# Altium schematic sheet ARM2toARM3Adapter.SchDoc: ARM2 to ARM3 Adapter
size A3; DocumentNumber: 1; SheetNumber: 1; SheetTotal: 1
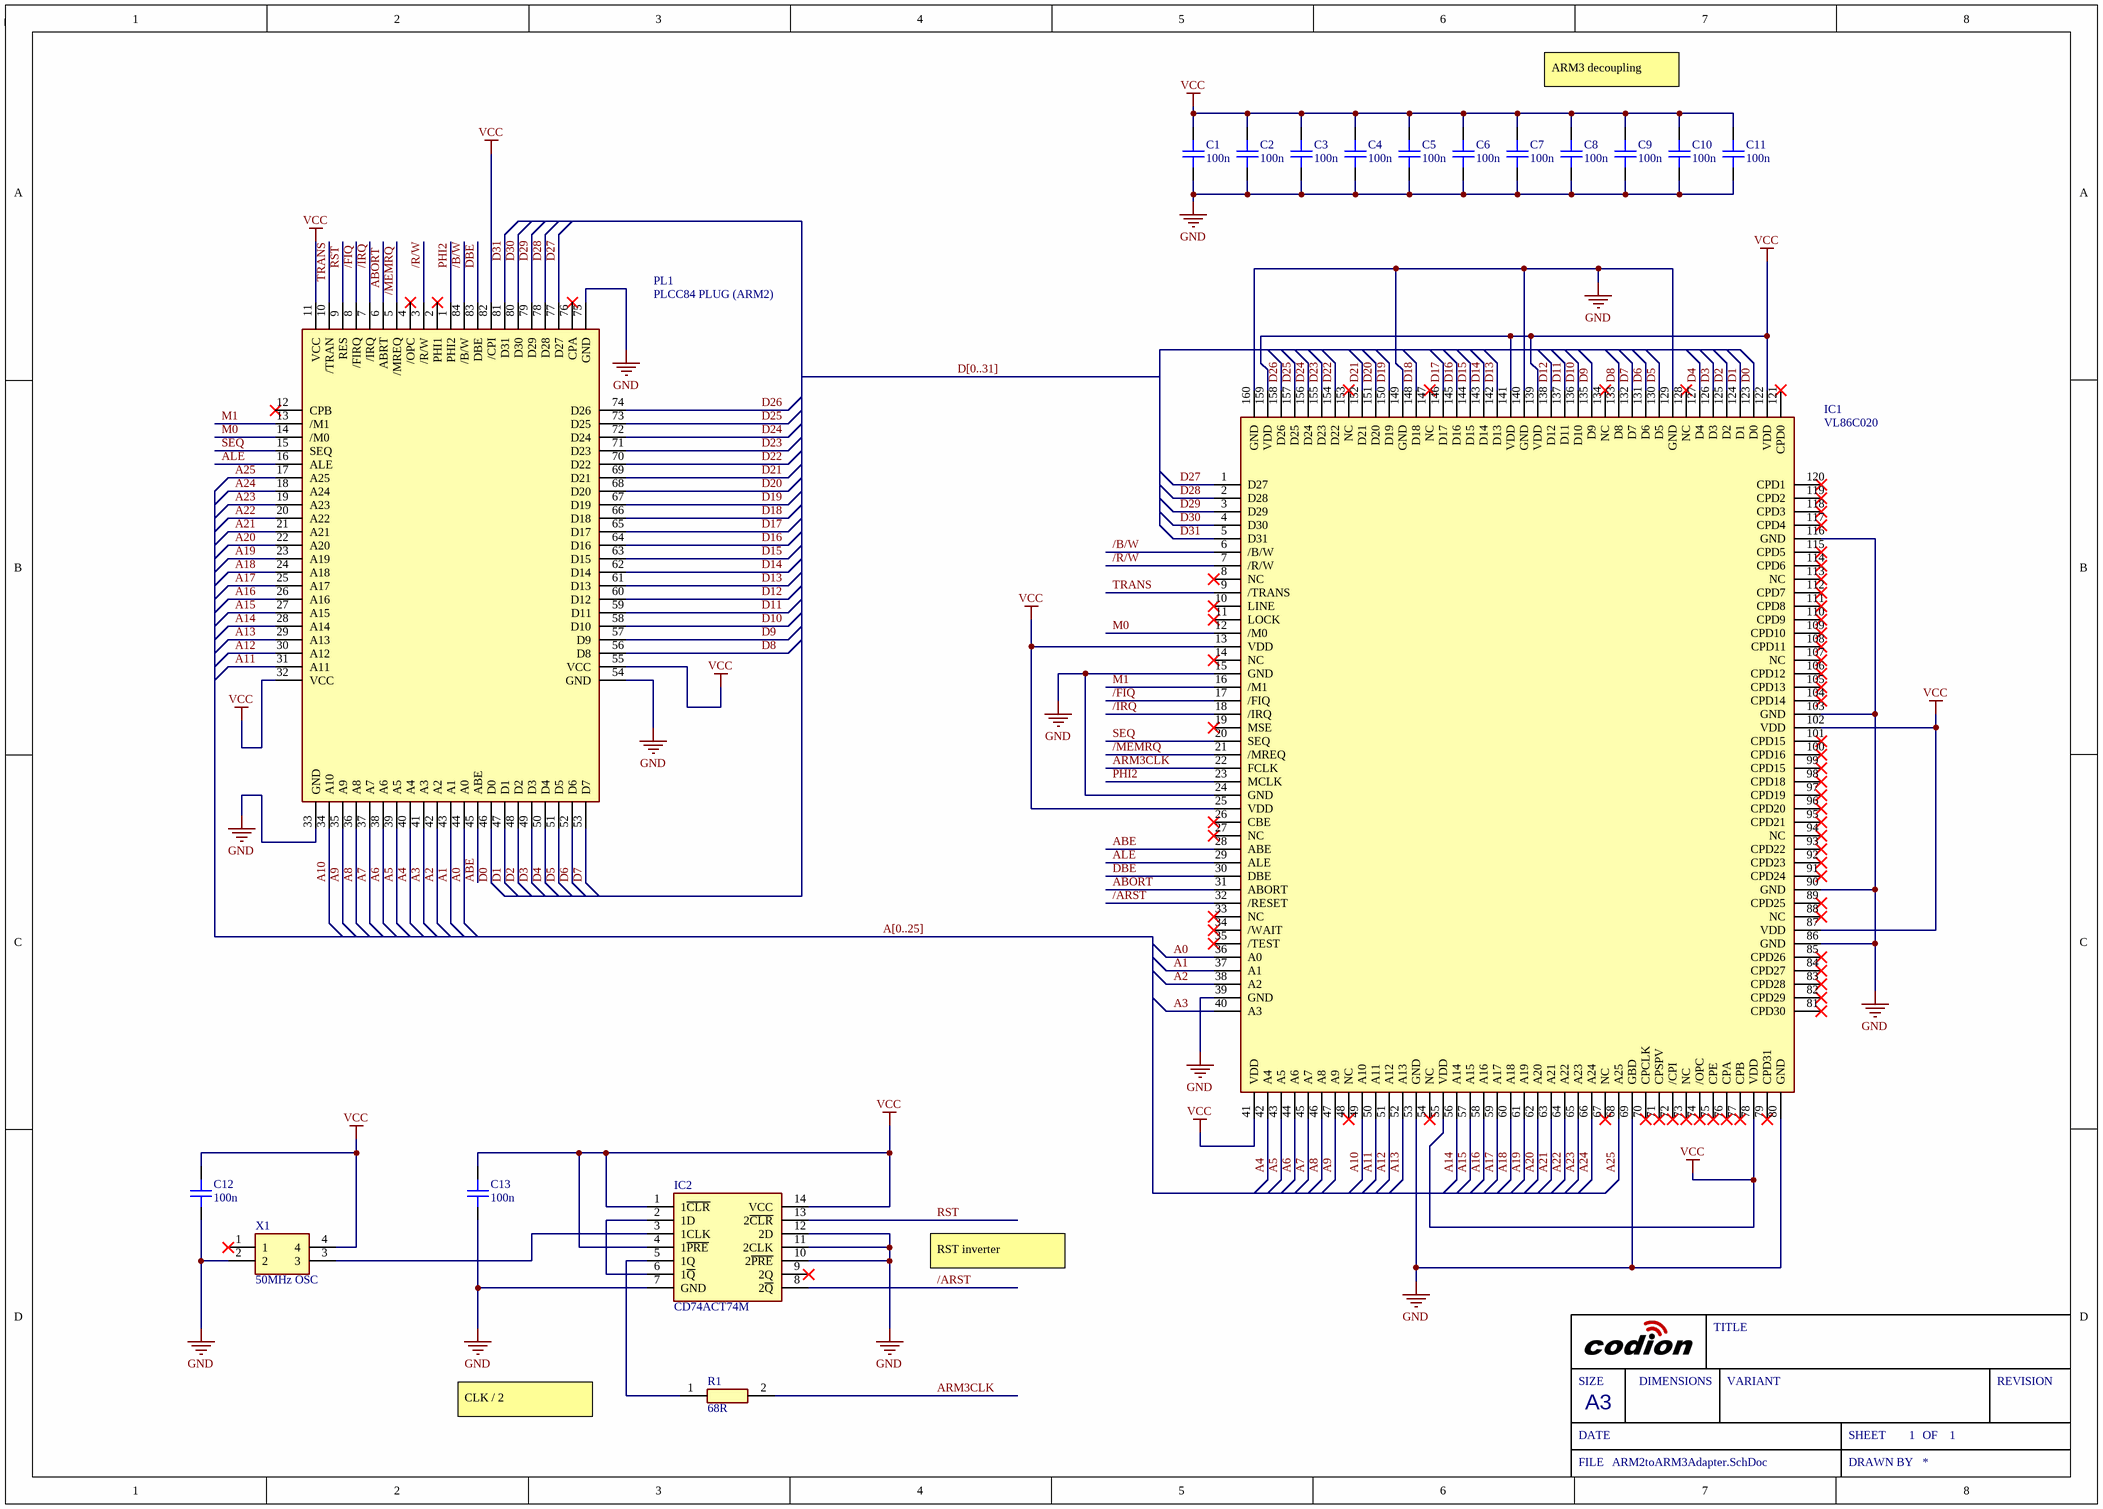
[diagram p0: ARM2toARM3Adapter.SchDoc]

## Parts
C1  100n  [CAPC1608L]
C2  100n  [CAPC1608L]
C3  100n  [CAPC1608L]
C4  100n  [CAPC1608L]
C5  100n  [CAPC1608L]
C6  100n  [CAPC1608L]
C7  100n  [CAPC1608L]
C8  100n  [CAPC1608L]
C9  100n  [CAPC1608L]
C10  100n  [CAPC1608L]
C11  100n  [CAPC1608L]
C12  100n  [CAPC1608L]
C13  100n  [CAPC1608L]
IC1  VL86C020  [QFP65P3120X3120X407-160N]
IC2  CD74ACT74M  [SOIC127P600X175-14N]
PL1  PLCC84 PLUG (ARM2)  [PLCC84_PLUG]
R1  value 68R  [RESC2012X50N]  (hidden comment: CRCW080568R0FKEA)
X1  50MHz OSC  [DIPS762W56P1524L1778H241Q4N]

## Nets
GND: C1.1 C2.1 C3.1 C4.1 C5.1 C6.1 C7.1 C8.1 C9.1 C10.1 C11.1 C12.1 C13.1 IC1.15(GND) IC1.24(GND) IC1.39(GND) IC1.53(GND) IC1.69(GBD) IC1.80(GND) IC1.86(GND) IC1.90(GND) IC1.103(GND) IC1.116(GND) IC1.129(GND) IC1.140(GND) IC1.149(GND) IC1.160(GND) IC2.7(GND) IC2.10(2~{PRE}) IC2.11(2CLK) IC2.12(2D) PL1.33(GND) PL1.54(GND) PL1.75(GND) X1.2
VCC: C1.2 C2.2 C3.2 C4.2 C5.2 C6.2 C7.2 C8.2 C9.2 C10.2 C11.2 C12.2 C13.2 IC1.13(VDD) IC1.25(VDD) IC1.41(VDD) IC1.55(VDD) IC1.78(VDD) IC1.87(VDD) IC1.102(VDD) IC1.122(VDD) IC1.139(VDD) IC1.141(VDD) IC1.159(VDD) IC2.1(1~{CLR}) IC2.4(1~{PRE}) IC2.14(VCC) PL1.11(VCC) PL1.32(VCC) PL1.55(VCC) PL1.82(/CPI) X1.4
/ARST: IC1.32(/RESET) IC2.8(2~{Q})
/B/W: IC1.6(/B/W) PL1.84(/B/W)
/FIQ: IC1.17(/FIQ) PL1.8(/FIRQ)
/IRQ: IC1.18(/IRQ) PL1.7(/IRQ)
/MEMRQ: IC1.21(/MREQ) PL1.5(/MREQ)
/R/W: IC1.7(/R/W) PL1.3(/R/W)
A0: IC1.36(A0) PL1.44(A0)
A1: IC1.37(A1) PL1.43(A1)
A2: IC1.38(A2) PL1.42(A2)
A3: IC1.40(A3) PL1.41(A3)
A4: IC1.42(A4) PL1.40(A4)
A5: IC1.43(A5) PL1.39(A5)
A6: IC1.44(A6) PL1.38(A6)
A7: IC1.45(A7) PL1.37(A7)
A8: IC1.46(A8) PL1.36(A8)
A9: IC1.47(A9) PL1.35(A9)
A10: IC1.49(A10) PL1.34(A10)
A11: IC1.50(A11) PL1.31(A11)
A12: IC1.51(A12) PL1.30(A12)
A13: IC1.52(A13) PL1.29(A13)
A14: IC1.56(A14) PL1.28(A14)
A15: IC1.57(A15) PL1.27(A15)
A16: IC1.58(A16) PL1.26(A16)
A17: IC1.59(A17) PL1.25(A17)
A18: IC1.60(A18) PL1.24(A18)
A19: IC1.61(A19) PL1.23(A19)
A20: IC1.62(A20) PL1.22(A20)
A21: IC1.63(A21) PL1.21(A21)
A22: IC1.64(A22) PL1.20(A22)
A23: IC1.65(A23) PL1.19(A23)
A24: IC1.66(A24) PL1.18(A24)
A25: IC1.68(A25) PL1.17(A25)
ABE: IC1.28(ABE) PL1.45(ABE)
ABORT: IC1.31(ABORT) PL1.6(ABRT)
ALE: IC1.29(ALE) PL1.16(ALE)
ARM3CLK: IC1.22(FCLK) R1.2
D0: IC1.123(D0) PL1.46(D0)
D1: IC1.124(D1) PL1.47(D1)
D2: IC1.125(D2) PL1.48(D2)
D3: IC1.126(D3) PL1.49(D3)
D4: IC1.127(D4) PL1.50(D4)
D5: IC1.130(D5) PL1.51(D5)
D6: IC1.131(D6) PL1.52(D6)
D7: IC1.132(D7) PL1.53(D7)
D8: IC1.133(D8) PL1.56(D8)
D9: IC1.135(D9) PL1.57(D9)
D10: IC1.136(D10) PL1.58(D10)
D11: IC1.137(D11) PL1.59(D11)
D12: IC1.138(D12) PL1.60(D12)
D13: IC1.142(D13) PL1.61(D13)
D14: IC1.143(D14) PL1.62(D14)
D15: IC1.144(D15) PL1.63(D15)
D16: IC1.145(D16) PL1.64(D16)
D17: IC1.146(D17) PL1.65(D17)
D18: IC1.148(D18) PL1.66(D18)
D19: IC1.150(D19) PL1.67(D19)
D20: IC1.151(D20) PL1.68(D20)
D21: IC1.152(D21) PL1.69(D21)
D22: IC1.154(D22) PL1.70(D22)
D23: IC1.155(D23) PL1.71(D23)
D24: IC1.156(D24) PL1.72(D24)
D25: IC1.157(D25) PL1.73(D25)
D26: IC1.158(D26) PL1.74(D26)
D27: IC1.1(D27) PL1.77(D27)
D28: IC1.2(D28) PL1.78(D28)
D29: IC1.3(D29) PL1.79(D29)
D30: IC1.4(D30) PL1.80(D30)
D31: IC1.5(D31) PL1.81(D31)
DBE: IC1.30(DBE) PL1.83(DBE)
M0: IC1.12(/M0) PL1.14(/M0)
M1: IC1.16(/M1) PL1.13(/M1)
PHI2: IC1.23(MCLK) PL1.1(PHI2)
RST: IC2.13(2~{CLR}) PL1.9(RES)
SEQ: IC1.20(SEQ) PL1.15(SEQ)
TRANS: IC1.9(/TRANS) PL1.10(/TRAN)
NetIC2_2: IC2.2(1D) IC2.6(1~{Q})
NetIC2_3: IC2.3(1CLK) X1.3
NetIC2_5: IC2.5(1Q) R1.1

Not connected (* = marked no-connect by the designer): IC1 8(NC)* 10(LINE)* 11(LOCK)* 14(NC)* 19(MSE)* 26(CBE)* 27(NC)* 33(NC)* 34(/WAIT)* 35(/TEST)* 48(NC)* 54(NC)* 67(NC)* 70(CPCLK)* 71(CPSPV)* 72(/CPI)* 73(NC)* 74(/OPC)* 75(CPE)* 76(CPA)* 77(CPB)* 79(CPD31)* 81(CPD30)* 82(CPD29)* 83(CPD28)* 84(CPD27)* 85(CPD26)* 88(NC)* 89(CPD25)* 91(CPD24)* 92(CPD23)* 93(CPD22)* 94(NC)* 95(CPD21)* 96(CPD20)* 97(CPD19)* 98(CPD18)* 99(CPD15)* 100(CPD16)* 101(CPD15)* 104(CPD14)* 105(CPD13)* 106(CPD12)* 107(NC)* 108(CPD11)* 109(CPD10)* 110(CPD9)* 111(CPD8)* 112(CPD7)* 113(NC)* 114(CPD6)* 115(CPD5)* 117(CPD4)* 118(CPD3)* 119(CPD2)* 120(CPD1)* 121(CPD0)* 128(NC)* 134(NC)* 147(NC)* 153(NC)*; IC2 9(2Q)*; PL1 2(PHI1)* 4(/OPC)* 12(CPB)* 76(CPA)*; X1 1*

## Buses and harness runs
bus A[0..25]
bus D[0..31]

## Notes on the sheet
- ARM3 decoupling
- RST inverter
- CLK / 2
- SIZE
- DIMENSIONS
- TITLE
- VARIANT
- REVISION
- DATE
- A3
- SHEET
- OF
- FILE
- DRAWN BY

## Library data of the parts
C1-C13 = CAP_100n_0603_50V_0: CAP 100nF, 0603, 50V, X7R, 10%; Manufacturer1: Samsung; ManuPart1: CL10B104KB8NNNC; ManuPart2: CC0603KRX7R9BB104; Value: 100n; Distributor1: Anglia; Manufacturer2: Yageo; Distributor2: Digikey; Distributor1 Part No: CL10B104KB8NNNC; Distributor2 Part No: 311-1344-2-ND; ComponentLinknURL: *; ComponentLink1Description: ComponentLinknURL1; ComponentLink1URL: https://media.digikey.com/pdf/Data%20Sheets/Samsung%20PDFs/CL_Series_MLCC_ds.pdf; ComponentLink2Description: ComponentLinknURL2; ComponentLink2URL: https://www.yageo.com/upload/media/product/productsearch/datasheet/mlcc/UPY-GPHC_X7R_6.3V-to-50V_18.pdf; Voltage: 50V
IC1 = SAA7146AH_V4,557: ARM3; Manufacturer_Name: VLSI; Manufacturer_Part_Number: VL86C)20; Height: 4.07mm
IC2 = CD74ACT74M: Integrated Circuit; Manufacturer_Name: Texas Instruments; Datasheet Link: http://www.ti.com/lit/ds/symlink/cd74act74.pdf; Height: 1.75mm; Manufacturer_Part_Number: CD74ACT74M; Mouser Part Number: 595-CD74ACT74M; Mouser Price/Stock: https://www.mouser.com/Search/Refine.aspx?Keyword=595-CD74ACT74M
PL1 = PLCC84_PLUG_ARM2: PLCC84 Plug; Manufacturer_Name: Winslow; Manufacturer_Part_Number: W9328; Height: 15mm
R1 = CRCW080568R0FKEA: 68R Resistor; Manufacturer_Name: Vishay; Datasheet Link: http://www.vishay.com/docs/20035/dcrcwe3.pdf; Height: 0.5mm; Manufacturer_Part_Number: CRCW080568R0FKEA; Mouser Part Number: 71-CRCW080568R0FKEA; Mouser Price/Stock: https://www.mouser.com/Search/Refine.aspx?Keyword=71-CRCW080568R0FKEA; Arrow Part Number: CRCW080568R0FKEA; Arrow Price/Stock: https://www.arrow.com/en/products/crcw080568r0fkea/vishay
X1 = 1107741: Manufacturer_Name: ARIES; Datasheet Link: http://docs-emea.rs-online.com/webdocs/13f3/0900766b813f3237.pdf; Height: 2.41mm; Manufacturer_Part_Number: 1107741; Mouser Part Number: 535-1107741; Mouser Price/Stock: https://www.mouser.co.uk/ProductDetail/Aries-Electronics/1107741?qs=WZRMhwwaLl%2FApwqojhfzdA%3D%3D